# EAGLE design WriteROM_32K_Proto (EAGLE 7.7.0)
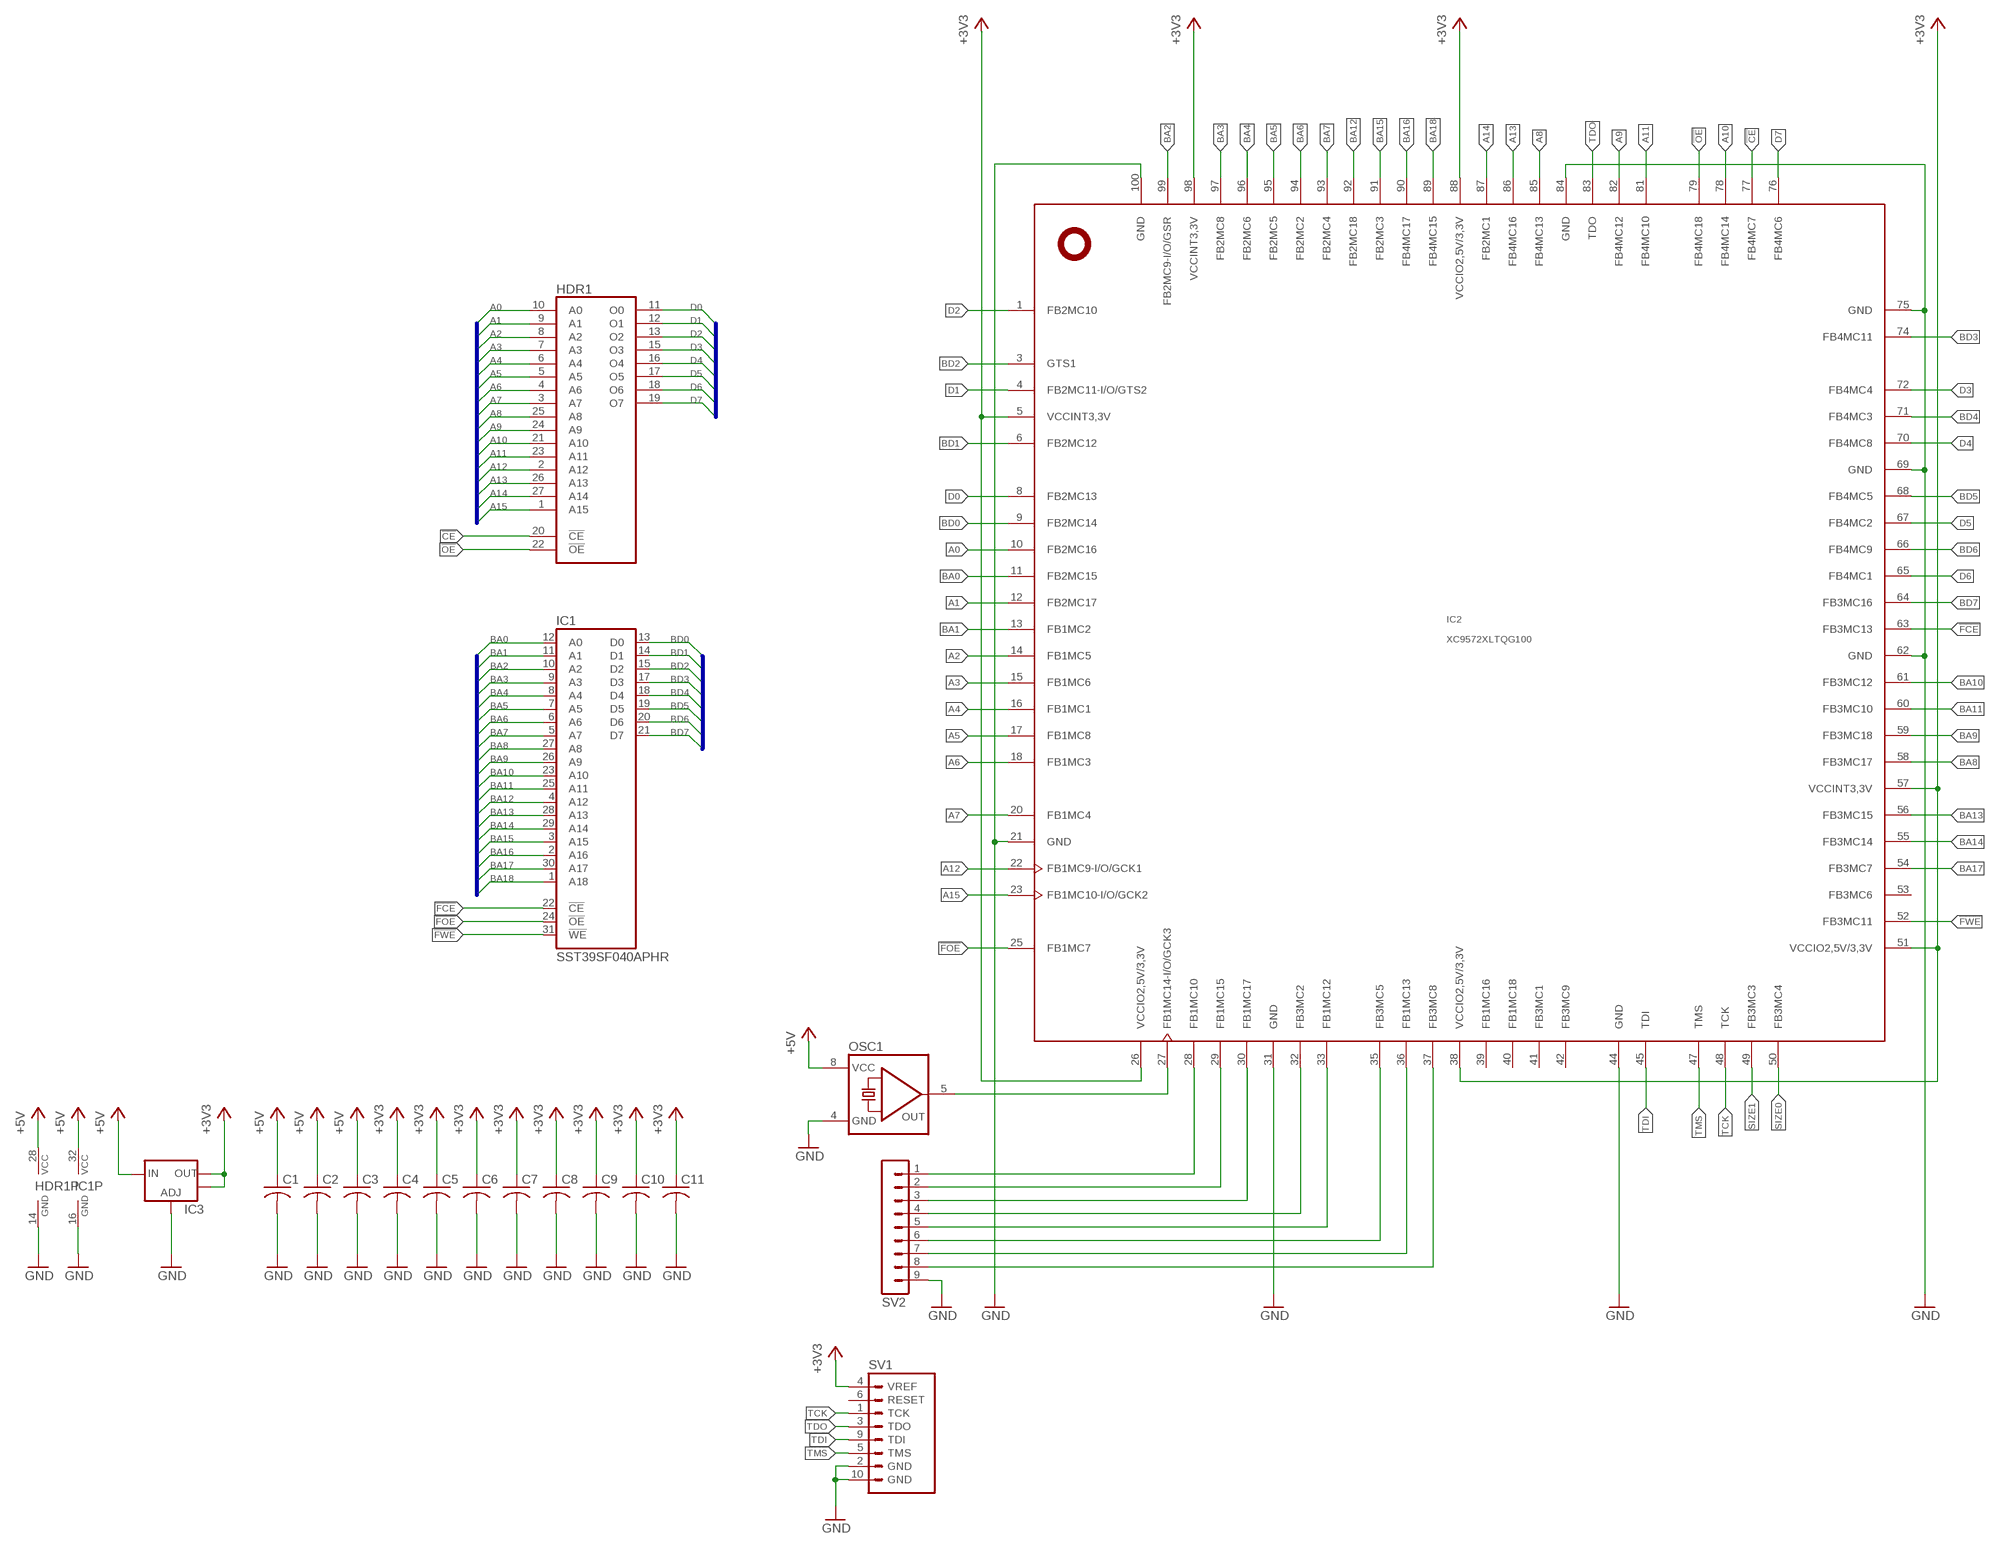
[diagram p0: schematic, sheet 1]

## Parts
C1  C-USC0805  [C0805]
C2  C-USC0402  [C0402]
C3  C-USC0402  [C0402]
C4  C-USC0805  [C0805]
C5  C-USC0402  [C0402]
C6  C-USC0402  [C0402]
C7  C-USC0402  [C0402]
C8  C-USC0402  [C0402]
C9  C-USC0402  [C0402]
C10  C-USC0402  [C0402]
C11  C-USC0402  [C0402]
HDR1  27512  [DIL28]
IC1  SST39SF040APHR  [DIL32-RP]
IC2  XC9572XLTQG100  [TQFP100]
IC3  V_REG_LM1117SOT223  [SOT223]
OSC1  QG5460  [DIL08S]
SV1  JTAG  [JTAG]
SV2  MA09-1  [MA09-1]

## Nets
!CE: HDR1.20(!CE) IC2.77(FB4MC7)
!FCE: IC1.22(!CE) IC2.63(FB3MC13)
!FOE: IC1.24(!OE) IC2.25(FB1MC7)
!FWE: IC1.31(!WE) IC2.52(FB3MC11)
!OE: HDR1.22(!OE) IC2.79(FB4MC18)
+3V3: C4.1 C5.1 C6.1 C7.1 C8.1 C9.1 C10.1 C11.1 IC2.5(VCCINT3,3V) IC2.26(VCCIO2,5V/3,3V) IC2.38(VCCIO2,5V/3,3V) IC2.51(VCCIO2,5V/3,3V) IC2.57(VCCINT3,3V) IC2.88(VCCIO2,5V/3,3V) IC2.98(VCCINT3,3V) IC3.2(OUT) IC3.4(OUT) SV1.4(VREF)
+5V: C1.1 C2.1 C3.1 HDR1.28(VCC) IC1.32(VCC) IC3.3(IN) OSC1.8(VCC)
A0: HDR1.10(A0) IC2.10(FB2MC16)
A1: HDR1.9(A1) IC2.12(FB2MC17)
A2: HDR1.8(A2) IC2.14(FB1MC5)
A3: HDR1.7(A3) IC2.15(FB1MC6)
A4: HDR1.6(A4) IC2.16(FB1MC1)
A5: HDR1.5(A5) IC2.17(FB1MC8)
A6: HDR1.4(A6) IC2.18(FB1MC3)
A7: HDR1.3(A7) IC2.20(FB1MC4)
A8: HDR1.25(A8) IC2.85(FB4MC13)
A9: HDR1.24(A9) IC2.82(FB4MC12)
A10: HDR1.21(A10) IC2.78(FB4MC14)
A11: HDR1.23(A11) IC2.81(FB4MC10)
A12: HDR1.2(A12) IC2.22(FB1MC9-I/O/GCK1)
A13: HDR1.26(A13) IC2.86(FB4MC16)
A14: HDR1.27(A14) IC2.87(FB2MC1)
A15: HDR1.1(A15) IC2.23(FB1MC10-I/O/GCK2)
BA0: IC1.12(A0) IC2.11(FB2MC15)
BA1: IC1.11(A1) IC2.13(FB1MC2)
BA2: IC1.10(A2) IC2.99(FB2MC9-I/O/GSR)
BA3: IC1.9(A3) IC2.97(FB2MC8)
BA4: IC1.8(A4) IC2.96(FB2MC6)
BA5: IC1.7(A5) IC2.95(FB2MC5)
BA6: IC1.6(A6) IC2.94(FB2MC2)
BA7: IC1.5(A7) IC2.93(FB2MC4)
BA8: IC1.27(A8) IC2.58(FB3MC17)
BA9: IC1.26(A9) IC2.59(FB3MC18)
BA10: IC1.23(A10) IC2.61(FB3MC12)
BA11: IC1.25(A11) IC2.60(FB3MC10)
BA12: IC1.4(A12) IC2.92(FB2MC18)
BA13: IC1.28(A13) IC2.56(FB3MC15)
BA14: IC1.29(A14) IC2.55(FB3MC14)
BA15: IC1.3(A15) IC2.91(FB2MC3)
BA16: IC1.2(A16) IC2.90(FB4MC17)
BA17: IC1.30(A17) IC2.54(FB3MC7)
BA18: IC1.1(A18) IC2.89(FB4MC15)
BD0: IC1.13(D0) IC2.9(FB2MC14)
BD1: IC1.14(D1) IC2.6(FB2MC12)
BD2: IC1.15(D2) IC2.3(GTS1)
BD3: IC1.17(D3) IC2.74(FB4MC11)
BD4: IC1.18(D4) IC2.71(FB4MC3)
BD5: IC1.19(D5) IC2.68(FB4MC5)
BD6: IC1.20(D6) IC2.66(FB4MC9)
BD7: IC1.21(D7) IC2.64(FB3MC16)
D0: HDR1.11(O0) IC2.8(FB2MC13)
D1: HDR1.12(O1) IC2.4(FB2MC11-I/O/GTS2)
D2: HDR1.13(O2) IC2.1(FB2MC10)
D3: HDR1.15(O3) IC2.72(FB4MC4)
D4: HDR1.16(O4) IC2.70(FB4MC8)
D5: HDR1.17(O5) IC2.67(FB4MC2)
D6: HDR1.18(O6) IC2.65(FB4MC1)
D7: HDR1.19(O7) IC2.76(FB4MC6)
GND: C1.2 C2.2 C3.2 C4.2 C5.2 C6.2 C7.2 C8.2 C9.2 C10.2 C11.2 HDR1.14(GND) IC1.16(GND) IC2.21(GND) IC2.31(GND) IC2.44(GND) IC2.62(GND) IC2.69(GND) IC2.75(GND) IC2.84(GND) IC2.100(GND) IC3.1(ADJ) OSC1.4(GND) SV1.2(GND) SV1.10(GND) SV2.9
N$14: IC2.27(FB1MC14-I/O/GCK3) OSC1.5(OUT)
SIZE0: IC2.50(FB3MC4)
SIZE1: IC2.49(FB3MC3)
TCK: IC2.48(TCK) SV1.1(TCK)
TDI: IC2.45(TDI) SV1.9(TDI)
TDO: IC2.83(TDO) SV1.3(TDO)
TES2: IC2.30(FB1MC17) SV2.3
TEST0: IC2.28(FB1MC10) SV2.1
TEST1: IC2.29(FB1MC15) SV2.2
TEST3: IC2.32(FB3MC2) SV2.4
TEST4: IC2.33(FB1MC12) SV2.5
TEST5: IC2.35(FB3MC5) SV2.6
TEST6: IC2.36(FB1MC13) SV2.7
TEST7: IC2.37(FB3MC8) SV2.8
TMS: IC2.47(TMS) SV1.5(TMS)
Unconnected: IC2.39(FB1MC16) IC2.40(FB1MC18) IC2.41(FB3MC1) IC2.42(FB3MC9) IC2.53(FB3MC6) SV1.6(RESET)

## Buses
BA[0..18]
D[0..7]
BD[0..7]
A[0..15]

## Library data of the parts
C1-C11 = rcl:C-US: CAPACITOR, American symbol
HDR1 = memory-rp:27512: MEMORY
IC1 = memory-sst:SST39SF040A: 4 Mbit x8 Multi-Purpose Flash Source: http://www.sst.com/dotAsset/40782.pdf
IC2 = xilinx_xc95XXXxl:XC9572XLTQG100
IC3 = SparkFun:V_REG_LM1117: Voltage Regulator LM1117 Standard adjustable voltage regulator but in SMD form. Spark Fun Electronics SKU : COM-00595
OSC1 = crystal:QG5460: CRYSTAL RESONATOR; OC_FARNELL: unknown; OC_NEWARK: unknown
SV1 = xilinx_xc95XXXxl:JTAG: PIN HEADER; OC_FARNELL: unknown; OC_NEWARK: unknown
SV2 = con-lstb-rp:MA09-1: PIN HEADER; OC_FARNELL: unknown; OC_NEWARK: unknown

## Board
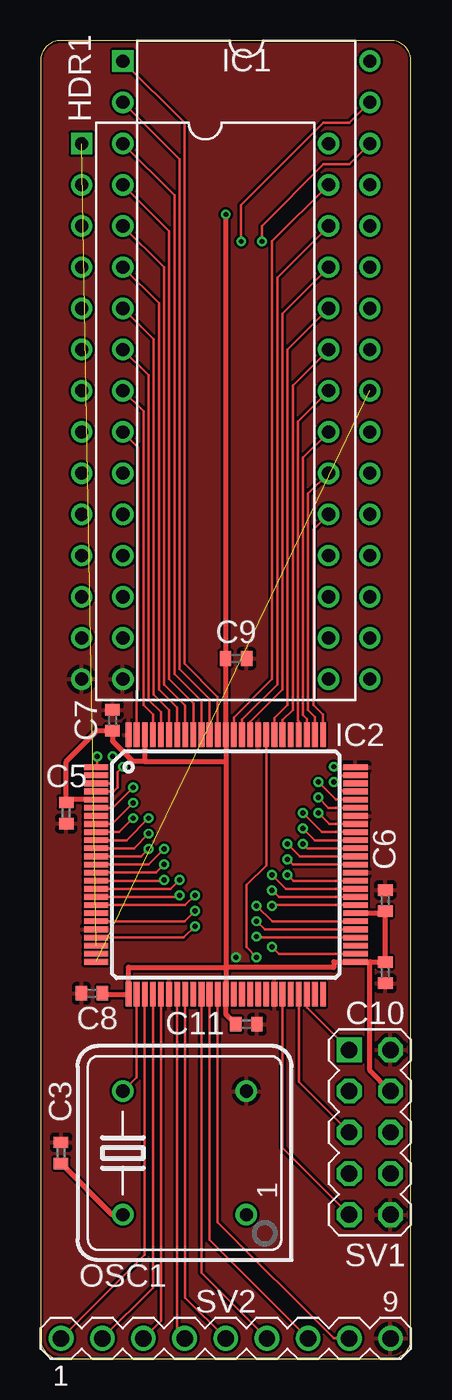
[diagram p1: board, top side]
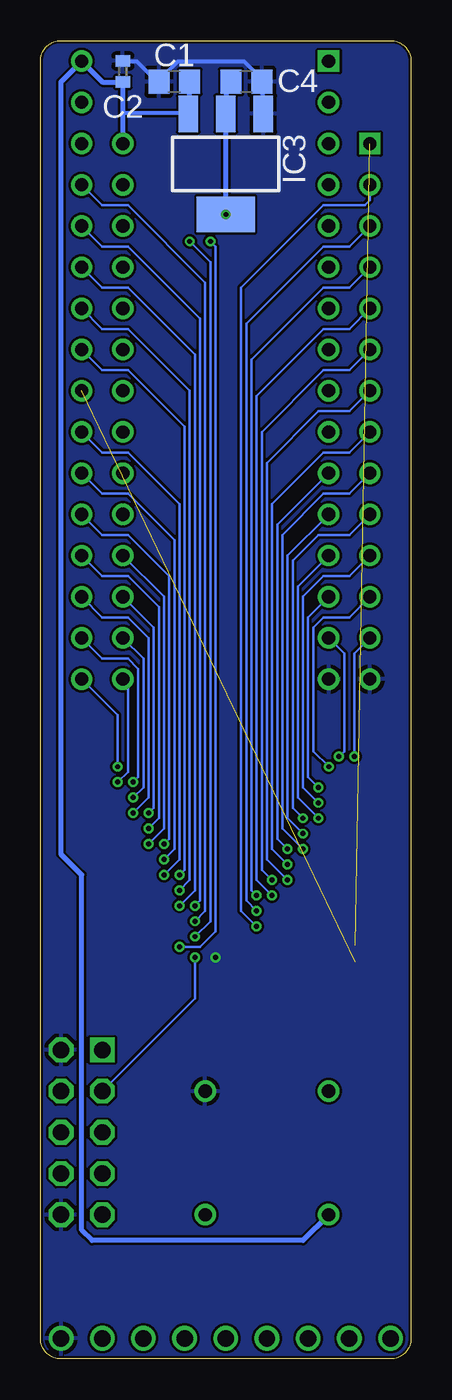
[diagram p2: board, bottom side, seen from below]

Size 22.86 x 81.28 mm. Coordinates in mm from the lower left corner, seen from the top.
Outline: 0,80.01 0,1.27 arc90 1.27,0 21.59,0 arc90 22.86,1.27 22.86,80.01 arc90 21.59,81.28 1.27,81.28 arc90 0,80.01
Copper layers (1*16): Top 0.035mm / dielectric 1.5mm / Bottom 0.035mm
Design rules "hackvana": minimum track width 6mil, minimum drill 0.3mm, track to track 6mil, track to pad 6mil, pad to pad 6mil, via to via 6mil, smd to smd 0mil, copper to edge 6mil, drill to drill 6mil, minimum pad ring 10mil, minimum via ring 6mil, stop-mask expansion 2mil, vias tented up to drill 100mil, thermal gap 10mil

### Footprints (pad centres in the part's own frame; a part is rotated, then mirrored left to right if it is on the bottom)
C0805 = smd 1.3 x 1.5: 1 -0.95,0; 2 0.95,0
C0402 = smd 0.7 x 0.9: 1 -0.65,0; 2 0.65,0
DIL28 = drill 0.813 square: 1 -16.51,-7.62 | drill 0.813: 2 -13.97,-7.62; 3 -11.43,-7.62; 4 -8.89,-7.62; 5 -6.35,-7.62; 6 -3.81,-7.62; 7 -1.27,-7.62; 8 1.27,-7.62; 9 3.81,-7.62; 10 6.35,-7.62; 11 8.89,-7.62; 12 11.43,-7.62; 13 13.97,-7.62; 14 16.51,-7.62; 15 16.51,7.62; 16 13.97,7.62; 17 11.43,7.62; 18 8.89,7.62; 19 6.35,7.62; 20 3.81,7.62; 21 1.27,7.62; 22 -1.27,7.62; 23 -3.81,7.62; 24 -6.35,7.62; 25 -8.89,7.62; 26 -11.43,7.62; 27 -13.97,7.62; 28 -16.51,7.62
DIL32-RP = drill 0.813 square: 1 -19.05,-7.62 | drill 0.813: 2 -16.51,-7.62; 3 -13.97,-7.62; 4 -11.43,-7.62; 5 -8.89,-7.62; 6 -6.35,-7.62; 7 -3.81,-7.62; 8 -1.27,-7.62; 9 1.27,-7.62; 10 3.81,-7.62; 11 6.35,-7.62; 12 8.89,-7.62; 13 11.43,-7.62; 14 13.97,-7.62; 15 16.51,-7.62; 16 19.05,-7.62; 17 19.05,7.62; 18 16.51,7.62; 19 13.97,7.62; 20 11.43,7.62; 21 8.89,7.62; 22 6.35,7.62; 23 3.81,7.62; 24 1.27,7.62; 25 -1.27,7.62; 26 -3.81,7.62; 27 -6.35,7.62; 28 -8.89,7.62; 29 -11.43,7.62; 30 -13.97,7.62; 31 -16.51,7.62; 32 -19.05,7.62
TQFP100 = smd 1.5 x 0.35: 1 -8,6; 2 -8,5.5; 3 -8,5; 4 -8,4.5; 5 -8,4; 6 -8,3.5; 7 -8,3; 8 -8,2.5; 9 -8,2; 10 -8,1.5; 11 -8,1; 12 -8,0.5; 13 -8,0; 14 -8,-0.5; 15 -8,-1; 16 -8,-1.5; 17 -8,-2; 18 -8,-2.5; 19 -8,-3; 20 -8,-3.5; 21 -8,-4; 22 -8,-4.5; 23 -8,-5; 24 -8,-5.5; 25 -8,-6; 51 8,-6; 52 8,-5.5; 53 8,-5; 54 8,-4.5; 55 8,-4; 56 8,-3.5; 57 8,-3; 58 8,-2.5; 59 8,-2; 60 8,-1.5; 61 8,-1; 62 8,-0.5; 63 8,0; 64 8,0.5; 65 8,1; 66 8,1.5; 67 8,2; 68 8,2.5; 69 8,3; 70 8,3.5; 71 8,4; 72 8,4.5; 73 8,5; 74 8,5.5; 75 8,6 | smd 0.35 x 1.5: 26 -6,-8; 27 -5.5,-8; 28 -5,-8; 29 -4.5,-8; 30 -4,-8; 31 -3.5,-8; 32 -3,-8; 33 -2.5,-8; 34 -2,-8; 35 -1.5,-8; 36 -1,-8; 37 -0.5,-8; 38 0,-8; 39 0.5,-8; 40 1,-8; 41 1.5,-8; 42 2,-8; 43 2.5,-8; 44 3,-8; 45 3.5,-8; 46 4,-8; 47 4.5,-8; 48 5,-8; 49 5.5,-8; 50 6,-8; 76 6,8; 77 5.5,8; 78 5,8; 79 4.5,8; 80 4,8; 81 3.5,8; 82 3,8; 83 2.5,8; 84 2,8; 85 1.5,8; 86 1,8; 87 0.5,8; 88 0,8; 89 -0.5,8; 90 -1,8; 91 -1.5,8; 92 -2,8; 93 -2.5,8; 94 -3,8; 95 -3.5,8; 96 -4,8; 97 -4.5,8; 98 -5,8; 99 -5.5,8; 100 -6,8
SOT223 = smd 1.219 x 2.235: 1 -2.311,-3.099; 2 0,-3.099; 3 2.311,-3.099 | smd 3.6 x 2.2: 4 0,3.099
DIL08S = drill 0.813: 1 -3.81,-3.81; 4 3.81,-3.81; 5 3.81,3.81; 8 -3.81,3.81
JTAG = drill 1.016 square: 1 -5.08,-1.27 | drill 1.016 octagon: 2 -5.08,1.27; 3 -2.54,-1.27; 4 -2.54,1.27; 5 0,-1.27; 6 0,1.27; 7 2.54,-1.27; 8 2.54,1.27; 9 5.08,-1.27; 10 5.08,1.27
MA09-1 = drill 1.016: 1 -10.16,0; 2 -7.62,0; 3 -5.08,0; 4 -2.54,0; 5 0,0; 6 2.54,0; 7 5.08,0; 8 7.62,0; 9 10.16,0

### Placement (x,y rotation side)
C1  14.61,78.74 180 bottom
C2  17.78,79.38 90 bottom
C3  1.27,12.7 90 top
C4  10.16,78.74 0 bottom
C5  1.59,33.66 270 top
C6  21.27,28.26 90 top
C7  4.44,39.37 90 top
C8  3.17,22.54 180 top
C9  12.06,43.18 0 top
C10  21.27,23.81 270 top
C11  12.7,20.64 0 top
HDR1  10.16,58.42 270 top
IC1  12.7,60.96 270 top
IC2  11.43,30.48 0 top
IC3  11.43,73.66 180 bottom
OSC1  8.89,12.7 90 top
SV1  20.32,13.97 270 top
SV2  11.43,1.27 0 top

### Tracks (layer width: path | path; a pad name or v marks a point on that pad's centre or on a via)
!CE
  Top 0.152: HDR1.20 16.51,53.34 16.51,40 16.93,39.59 IC2.77
!FCE  (via drill 0.3)
  Top 0.152: IC2.63 15.56,30.48 v15.24,30.8
  Bottom 0.152: v15.24,30.8 14.61,31.43 14.61,50.48 17.46,53.34 19.05,53.34 IC1.22
!FOE  (1 unrouted)
!FWE  (via drill 0.3)
  Top 0.152: IC1.31 19.05,76.2 17.46,76.2 12.38,71.12 v12.38,68.9 | IC2.52 14.71,24.98 v14.29,25.4
  Bottom 0.152: v12.38,68.9 12.06,68.58 12.06,26.35 13.02,25.4 v14.29,25.4
!OE
  Top 0.152: HDR1.22 15.88,57.79 15.88,39.37 15.93,39.31 IC2.79
+3V3  (via drill 0.3)
  Top 0.305: 11.43,41.91 IC2.88 11.43,36.83 | 11.43,41.91 IC3.4 | 6.43,36.83 5.71,36.83 4.44,38.1 C7.1 4.43,38.73 3.49,38.73 1.59,36.83 C5.1 1.76,34.48 IC2.5 | 20.32,24.48 IC2.51 18.1,24.48 18.1,24.13 11.43,24.13 | 20.32,24.48 21.23,24.48 C10.1 C6.1 21.14,27.48 IC2.57 | SV1.4 20.32,17.78 20.32,24.48 | 11.43,24.14 5.43,24.14 IC2.26 3.82,22.48 C8.1 | IC2.98 6.43,36.83 | C9.1 11.41,41.91 11.43,41.91 | 11.43,36.83 11.43,24.14 | 6.43,36.83 11.43,36.83 | 11.43,24.13 IC2.38 11.43,21.26 C11.1 | 11.43,24.14 11.43,24.13
  Bottom 0.305: IC3.4 IC3.2 11.43,78.42 C4.1
  other vias: 11.43,70.56
+5V
  Top 0.305: C3.1 4.43,8.89 OSC1.8
  Bottom 0.254: 17.78,76.84 13.97,76.84 IC3.3
  Bottom 0.305: 13.74,78.65 C1.1 13.65,76.84 IC3.3 | HDR1.28 17.78,76.84 C2.1 19.04,78.72 IC1.32 21.59,78.74 21.59,31.12 20.32,29.84 20.32,7.94 19.69,7.3 6.67,7.3 OSC1.8
A0  (via drill 0.3)
  Top 0.152: IC2.10 5.31,31.98 v6.67,33.34
  Bottom 0.152: HDR1.10 3.81,50.8 5.71,50.8 7.3,49.21 7.3,33.97 v6.67,33.34
A1  (via drill 0.3)
  Top 0.152: IC2.12 6.21,30.98 v6.67,31.43
  Bottom 0.152: HDR1.9 3.81,53.34 5.4,53.34 7.94,50.8 7.94,32.7 v6.67,31.43
A2  (via drill 0.3)
  Top 0.152: IC2.14 7.12,29.98 v7.62,30.48
  Bottom 0.152: HDR1.8 3.81,55.88 5.4,55.88 8.57,52.7 8.57,31.43 v7.62,30.48
A3  (via drill 0.3)
  Top 0.152: IC2.15 7.57,29.48 v7.62,29.53
  Bottom 0.152: HDR1.7 3.81,58.42 5.71,58.42 8.89,55.24 8.89,30.8 v7.62,29.53
A4  (via drill 0.3)
  Top 0.152: IC2.16 8.03,28.98 v8.57,29.53
  Bottom 0.152: HDR1.6 3.81,60.96 5.4,60.96 9.21,57.15 9.21,30.16 v8.57,29.53
A5  (via drill 0.3)
  Top 0.152: IC2.17 8.48,28.48 v8.57,28.58
  Bottom 0.152: HDR1.5 3.81,63.5 5.4,63.5 9.53,59.37 9.53,29.53 v8.57,28.58
A6  (via drill 0.3)
  Top 0.152: IC2.18 8.93,27.98 v9.53,28.58
  Bottom 0.152: HDR1.4 3.81,66.04 5.4,66.04 9.84,61.59 9.84,28.89 v9.53,28.58
A7  (via drill 0.3)
  Top 0.152: IC2.20 8.88,26.98 v9.53,27.62
  Bottom 0.152: HDR1.3 3.81,68.58 5.4,68.58 10.16,63.82 10.16,28.26 v9.53,27.62
A8
  Top 0.152: HDR1.25 14.92,64.45 14.92,41.27 12.93,39.28 IC2.85
A9
  Top 0.152: HDR1.24 15.24,62.23 15.24,40.32 14.43,39.51 IC2.82
A10
  Top 0.152: HDR1.21 16.19,55.56 16.19,39.69 16.43,39.45 IC2.78
A11
  Top 0.152: HDR1.23 15.56,60.01 15.56,40 14.93,39.38 IC2.81
A12  (via drill 0.3)
  Top 0.152: IC2.22 8.83,25.98 v9.53,26.67
  Bottom 0.152: HDR1.2 2.54,71.44 2.86,71.12 5.4,71.12 10.48,66.04 10.48,27.62 v9.53,26.67
A13
  Top 0.152: HDR1.26 14.61,66.67 14.61,41.59 12.43,39.42 IC2.86
A14
  Top 0.152: HDR1.27 14.29,68.9 14.29,41.91 11.93,39.55 IC2.87
A15  (1 unrouted)
BA0  (via drill 0.3)
  Top 0.152: IC2.11 5.76,31.48 v6.67,32.38
  Bottom 0.152: IC1.12 7.62,49.53 7.62,33.34 v6.67,32.38
BA1  (via drill 0.3)
  Top 0.152: IC2.13 6.67,30.48 v7.62,31.43
  Bottom 0.152: IC1.11 8.25,51.44 8.25,32.07 v7.62,31.43
BA2
  Top 0.152: IC2.99 5.93,41.17 6.03,41.27 6.03,56.2 IC1.10
BA3
  Top 0.152: IC2.97 6.93,39.74 6.35,40.32 6.35,58.42 IC1.9
BA4
  Top 0.152: IC1.8 6.67,60.64 6.67,40.64 7.43,39.88 IC2.96
BA5
  Top 0.152: IC1.7 6.98,62.87 6.98,40.96 7.93,40.01 IC2.95
BA6
  Top 0.152: IC1.6 7.3,65.09 7.3,41.27 8.43,40.15 IC2.94
BA7
  Top 0.152: IC1.5 7.62,67.31 7.62,41.59 8.93,40.28 IC2.93
BA8  (via drill 0.3)
  Top 0.152: IC2.58 14.33,27.98 v14.29,27.94
  Bottom 0.152: v14.29,27.94 13.33,28.89 13.33,61.91 17.46,66.04 19.05,66.04 IC1.27
BA9  (via drill 0.3)
  Top 0.152: IC2.59 14.7,28.48 v14.29,28.89
  Bottom 0.152: v14.29,28.89 13.65,29.53 13.65,59.69 17.46,63.5 19.05,63.5 IC1.26
BA10  (via drill 0.3)
  Top 0.152: IC2.61 15.61,29.48 v15.24,29.84
  Bottom 0.152: v15.24,29.84 14.29,30.8 14.29,52.7 17.46,55.88 19.05,55.88 IC1.23
BA11  (via drill 0.3)
  Top 0.152: IC2.60 15.15,28.98 v14.29,29.84
  Bottom 0.152: v14.29,29.84 13.97,30.16 13.97,57.47 17.46,60.96 19.05,60.96 IC1.25
BA12
  Top 0.152: IC1.4 7.94,69.53 7.94,41.91 9.43,40.42 IC2.92
BA13  (via drill 0.3)
  Top 0.152: IC2.56 14.29,26.98 v13.33,27.94
  Bottom 0.152: IC1.28 19.05,68.58 17.46,68.58 13.02,64.13 13.02,28.26 v13.33,27.94
BA14  (via drill 0.3)
  Top 0.152: IC2.55 13.84,26.48 v13.33,26.99
  Bottom 0.152: v13.33,26.99 12.7,27.62 12.7,66.36 17.46,71.12 19.05,71.12 IC1.29
BA15
  Top 0.152: IC1.3 8.25,71.75 8.25,42.23 9.93,40.55 IC2.91
BA16
  Top 0.152: IC1.2 8.57,73.98 8.57,42.55 10.43,40.69 IC2.90
BA17  (via drill 0.3)
  Top 0.152: IC2.54 13.39,25.98 v13.33,26.04 | IC1.30 19.05,73.66 17.46,73.66 13.65,69.85 v13.65,68.9
  Bottom 0.152: v13.33,26.04 12.38,26.99 12.38,67.63 v13.65,68.9
BA18
  Top 0.152: IC1.1 8.89,76.2 8.89,42.86 10.93,40.82 IC2.89
BD0  (via drill 0.3)
  Top 0.152: v5.71,33.34 4.86,32.48 IC2.9
  Bottom 0.152: IC1.13 6.98,47.62 6.98,34.61 v5.71,33.34
BD1  (via drill 0.3)
  Top 0.152: v5.71,35.24 4.44,33.98 IC2.6
  Bottom 0.152: IC1.14 6.35,45.72 6.35,35.88 v5.71,35.24
BD2  (via drill 0.3)
  Top 0.152: v4.44,37.15 4.44,35.56 4.36,35.48 IC2.3
  Bottom 0.152: IC1.15 4.13,43.5 4.13,37.47 v4.44,37.15
BD3  (via drill 0.3)
  Top 0.152: IC2.74 18.63,35.98 v18.1,36.51
  Bottom 0.152: IC1.17 18.1,39.69 v18.1,36.51
BD4  (via drill 0.3)
  Top 0.152: IC2.71 18.23,34.48 v17.14,35.56
  Bottom 0.152: v17.14,35.56 16.83,35.88 16.83,42.55 17.46,43.18 19.05,43.18 IC1.18
BD5  (via drill 0.3)
  Top 0.152: IC2.68 17.82,32.98 v17.14,33.66
  Bottom 0.152: v17.14,33.66 16.19,34.61 16.19,36.83 16.19,37.47 16.19,44.45 17.46,45.72 19.05,45.72 IC1.19
BD6  (via drill 0.3)
  Top 0.152: IC2.66 16.91,31.98 v16.19,32.7
  Bottom 0.152: v16.19,32.7 15.56,33.34 15.56,43.81 15.56,44.45 15.56,46.36 17.46,48.26 19.05,48.26 IC1.20
BD7  (via drill 0.3)
  Top 0.152: IC2.64 16.01,30.98 v15.24,31.75
  Bottom 0.152: v15.24,31.75 14.92,32.07 14.92,45.4 14.92,45.72 14.92,48.26 17.46,50.8 19.05,50.8 IC1.21
D0  (via drill 0.3)
  Top 0.152: v5.71,34.29 4.4,32.98 IC2.8
  Bottom 0.152: HDR1.11 3.81,48.26 5.4,48.26 6.67,46.99 6.67,35.24 v5.71,34.29
D1  (via drill 0.3)
  Top 0.152: v5.08,36.51 4.76,36.2 4.76,35.24 4.5,34.98 IC2.4
  Bottom 0.152: HDR1.12 3.81,45.72 5.4,45.72 6.03,45.09 6.03,37.47 v5.08,36.51
D2  (via drill 0.3)
  Top 0.152: v3.49,37.15 3.49,36.48 IC2.1
  Bottom 0.152: HDR1.13 3.49,43.5 v3.49,37.15
D3  (via drill 0.3)
  Top 0.152: IC2.72 18.68,34.98 v18.1,35.56
  Bottom 0.152: HDR1.15 17.46,41.59 17.46,36.2 v18.1,35.56
D4  (via drill 0.3)
  Top 0.152: IC2.70 17.77,33.98 v17.14,34.61
  Bottom 0.152: v17.14,34.61 16.51,35.24 16.51,43.18 HDR1.16
D5  (via drill 0.3)
  Top 0.152: IC2.67 17.37,32.48 v16.19,33.66
  Bottom 0.152: v16.19,33.66 15.88,33.97 15.88,45.09 HDR1.17
D6  (via drill 0.3)
  Top 0.152: IC2.65 16.46,31.48 v16.19,31.75
  Bottom 0.152: v16.19,31.75 15.24,32.7 15.24,46.99 HDR1.18
D7
  Top 0.152: HDR1.19 16.83,51.12 16.83,40.32 17.43,39.72 IC2.76
GND  (via drill 0.3)
  Top 0.254: 5.4,38.73 IC2.100
  Bottom 0.254: C2.2 17.6,79.98 16.92,79.98 15.77,78.84 C1.2 15.54,78.84 14.4,79.98 10.29,79.98 9.14,78.84 C4.2 9.14,78.61 9.14,76.78 IC3.1
  other vias: 12.06,24.77
  pour Top: 1.27,0 21.59,0 arc90 22.86,1.27 22.86,80.01 arc90 21.59,81.28 1.27,81.28 arc90 0,80.01 0,1.27 arc90
  pour Bottom: 1.27,0 21.59,0 arc90 22.86,1.27 22.86,80.01 arc90 21.59,81.28 1.27,81.28 arc90 0,80.01 0,1.27 arc90
N$14
  Top 0.152: OSC1.5 5.93,17.36 IC2.27
TCK
  Top 0.152: IC2.48 16.43,21.67 SV1.1
TDI
  Top 0.152: IC2.45 14.93,13.01 SV1.9
TDO  (via drill 0.3)
  Top 0.152: IC2.83 13.93,30.44 12.7,29.21 12.7,25.4 v13.33,24.77
  Bottom 0.152: SV1.3 13.33,22.23 v13.33,24.77
TES2
  Top 0.152: IC2.30 7.43,11.43 7.43,11.24 7.43,2.35 SV2.3
TEST0
  Top 0.152: IC2.28 6.43,6.43 SV2.1
TEST1
  Top 0.152: IC2.29 6.93,4.39 SV2.2
TEST3
  Top 0.152: IC2.32 8.43,1.73 SV2.4
TEST4
  Top 0.152: IC2.33 8.93,9.21 8.93,8.85 8.93,3.77 SV2.5
TEST5
  Top 0.152: IC2.35 9.93,5.31 SV2.6
TEST6
  Top 0.152: IC2.36 10.43,9.53 10.43,9.26 10.43,7.35 SV2.7
TEST7
  Top 0.152: IC2.37 10.93,8.44 18.1,1.27 SV2.8
TMS
  Top 0.152: IC2.47 15.93,17.09 SV1.5